# EAGLE design Conduino-V03 (EAGLE 8.5.2)
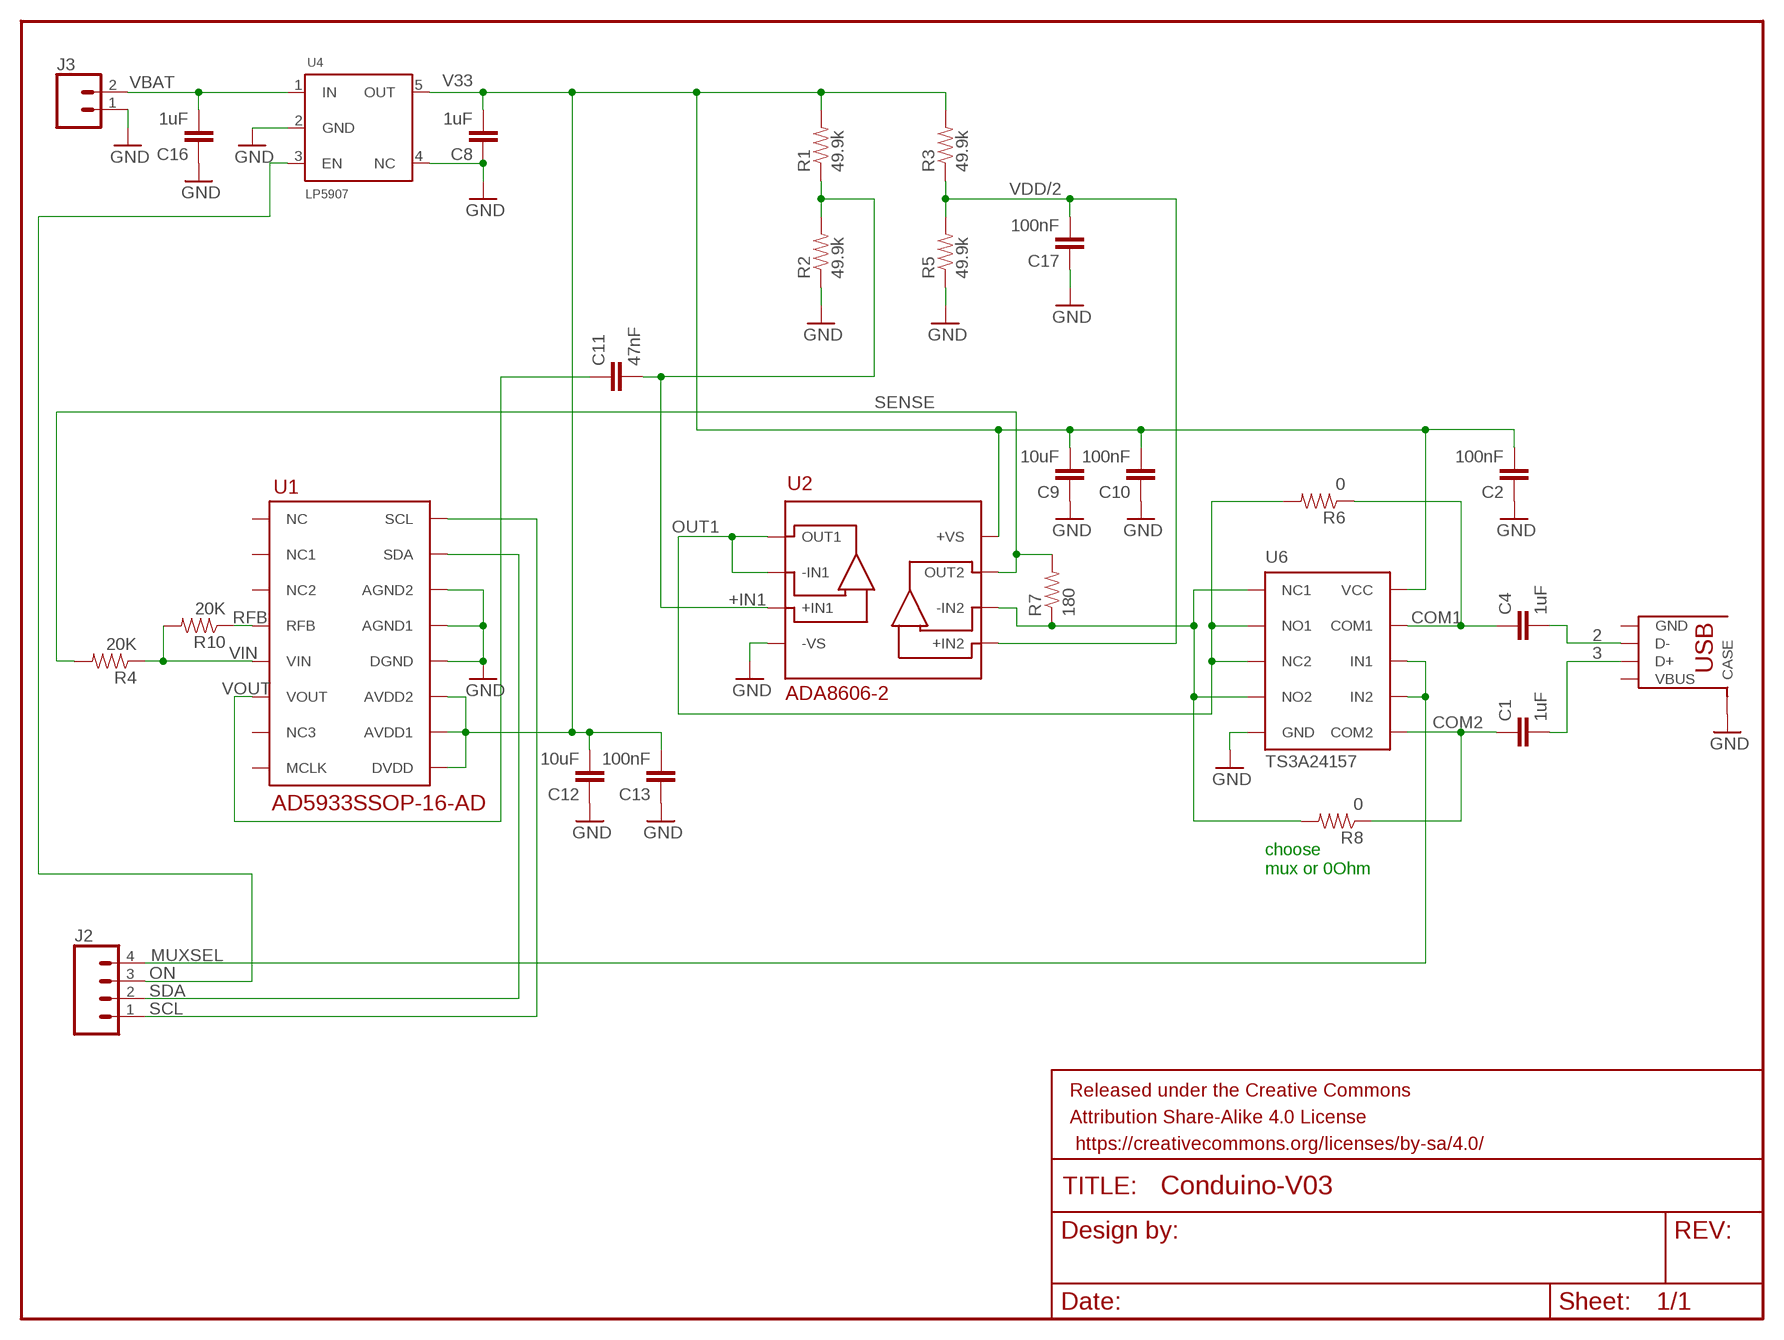
[diagram p0: schematic, sheet 1]

## Parts
C1  1uF  CAP0603-CAP  [0603-CAP]
C2  100nF  CAP0603-CAP  [0603-CAP]
C4  1uF  CAP0603-CAP  [0603-CAP]
C8  1uF  CAP0603-CAP  [0603-CAP]
C9  10uF  CAP0603-CAP  [0603-CAP]
C10  100nF  CAP0603-CAP  [0603-CAP]
C11  47nF  CAP0603-CAP  [0603-CAP]
C12  10uF  CAP0603-CAP  [0603-CAP]
C13  100nF  CAP0603-CAP  [0603-CAP]
C16  1uF  CAP0603-CAP  [0603-CAP]
C17  100nF  CAP0603-CAP  [0603-CAP]
FRAME1  FRAME-LETTER  [CREATIVE_COMMONS]
J1  USBA-SIDE  [USBA-SIDE]
J2  CONN_041X04_NO_SILK  [1X04_NO_SILK]
J3  CONN_021X02_NO_SILK  [1X02_NO_SILK]
R1  49.9k  RESISTOR0603-RES  [0603-RES]
R2  49.9k  RESISTOR0603-RES  [0603-RES]
R3  49.9k  RESISTOR0603-RES  [0603-RES]
R4  20K  RESISTOR0603-RES  [0603-RES]
R5  49.9k  RESISTOR0603-RES  [0603-RES]
R6  0  RESISTOR0603-RES  [0603-RES]
R7  180  RESISTOR0603-RES  [0603-RES]
R8  0  RESISTOR0603-RES  [0603-RES]
R10  20K  RESISTOR0603-RES  [0603-RES]
U1  AD5933SSOP-16-AD  [SSOP-16-AD]
U2  ADA8606-2  [SOIC_N]
U4  LP5907  [SOT23-5L]
U6  TS3A24157  [VSSOP-10]

## Nets
2: C4.2 J1.P$2(D-)
3: C1.2 J1.P$3(D+)
+IN1: C11.2 R1.1 R2.2 U2.P$3(+IN1)
-IN2: R7.1 R8.2 U2.P$6(-IN2) U6.P$1(NC1) U6.P$4(NO2)
COM1: C4.1 R6.1 U6.P$9(COM1)
COM2: C1.1 R8.1 U6.P$6(COM2)
GND: C2.1 C8.1 C9.1 C10.1 C12.1 C13.1 C16.1 C17.1 J1.P$5(CASE) J1.P$6(CASE) J3.1 R2.1 R5.1 U1.P$12(DGND) U1.P$13(AGND1) U1.P$14(AGND2) U2.P$4(-VS) U4.2(GND) U4.4(NC) U6.P$5(GND)
MUXSEL: J2.4 U6.P$7(IN2) U6.P$8(IN1)
ON: J2.3 U4.3(EN)
OUT1: R6.2 U2.P$1(OUT1) U2.P$2(-IN1) U6.P$2(NO1) U6.P$3(NC2)
RFB: R10.1 U1.P$4(RFB)
SCL: J2.1 U1.P$16(SCL)
SDA: J2.2 U1.P$15(SDA)
SENSE: R4.2 R7.2 U2.P$7(OUT2)
V33: C2.2 C8.2 C9.2 C10.2 C12.2 C13.2 R1.2 R3.2 U1.P$9(DVDD) U1.P$10(AVDD1) U1.P$11(AVDD2) U2.P$8(+VS) U4.5(OUT) U6.P$10(VCC)
VBAT: C16.2 J3.2 U4.1(IN)
VDD/2: C17.2 R3.1 R5.2 U2.P$5(+IN2)
VIN: R4.1 R10.2 U1.P$5(VIN)
VOUT: C11.1 U1.P$6(VOUT)
Unconnected: J1.P$1(GND) J1.P$4(VBUS) U1.P$1(NC) U1.P$2(NC1) U1.P$3(NC2) U1.P$7(NC3) U1.P$8(MCLK)

## Notes on the sheet
- choose
  mux or 0Ohm

## Library data of the parts
C1 C2 C4 C8-C13 C16 C17 = SparkFun-Passives:CAP: Capacitor Standard 0603 ceramic capacitor, and 0.1" leaded capacitor.
FRAME1 = SparkFun-Aesthetics:FRAME-LETTER: Schematic Frame Standard 8.5x11 US Letter frame
J1 = KDA:USBA-SIDE
J2 = SparkFun-Connectors:CONN_04: Multi connection point. Often used as Generic Header-pin footprint for 0.1 inch spaced/style header connections On any of the 0.1 inch spaced packages, you can populate with these: Break Away Headers - Straight <https://www.sparkfun.com/products/116> (PRT-00116) Break Away Male Headers - Right Angle <https://www.sparkfun.com/products/553> (PRT-00553) Female Headers <https://www.sparkfun.com/products/115> (PRT-00115) Break Away Headers - Machine Pin <https://www.sparkfun.com/products/117> (PRT-00117) Break Away Female Headers - Swiss Machine Pin <https://www.sparkfun.com/products/743> (PRT-00743) For SCREWTERMINALS and SPRING TERMINALS visit here: Screw Terimnals on SparkFun.com <https://www.sparkfun.com/search/results?term=Screw+Terminals> (5mm/3.5mm/2.54mm spacing) This device is also useful as a general connection point to wire up your design to another part of your project. Our various solder wires solder well into these plated through hole pads. Hook-Up Wire - Assortment (Stranded, 22 AWG) <https://www.sparkfun.com/products/11375> (PRT-11375) Hook-Up Wire - Assortment (Solid Core, 22 AWG) <https://www.sparkfun.com/products/11367> (PRT-11367) View the entire wire category on our website here <https://www.sparkfun.com/categories/141> Special notes: Molex polarized connector foot print use with SKU : PRT-08231 with associated crimp pins and housings. 1MM SMD Version SKU: PRT-10208; PROD_ID: CONN-09696
J3 = SparkFun-Connectors:CONN_02: Multi connection point. Often used as Generic Header-pin footprint for 0.1 inch spaced/style header connections On any of the 0.1 inch spaced packages, you can populate with these: Break Away Headers - Straight <https://www.sparkfun.com/products/116> (PRT-00116) Break Away Male Headers - Right Angle <https://www.sparkfun.com/products/553> (PRT-00553) Female Headers <https://www.sparkfun.com/products/115> (PRT-00115) Break Away Headers - Machine Pin <https://www.sparkfun.com/products/117> (PRT-00117) Break Away Female Headers - Swiss Machine Pin <https://www.sparkfun.com/products/743> (PRT-00743) For SCREWTERMINALS and SPRING TERMINALS visit here: Screw Terimnals on SparkFun.com <https://www.sparkfun.com/search/results?term=Screw+Terminals> (5mm/3.5mm/2.54mm spacing) This device is also useful as a general connection point to wire up your design to another part of your project. Our various solder wires solder well into these plated through hole pads. Hook-Up Wire - Assortment (Stranded, 22 AWG) <https://www.sparkfun.com/products/11375> (PRT-11375) Hook-Up Wire - Assortment (Solid Core, 22 AWG) <https://www.sparkfun.com/products/11367> (PRT-11367) View the entire wire category on our website here <https://www.sparkfun.com/categories/141> Special notes: Molex polarized connector foot print use with: PRT-08233 with associated crimp pins and housings. 2.54_SCREWTERM for use with PRT-10571. 3.5mm Screw Terminal footprints for PRT-08084 5mm Screw Terminal footprints for use with PRT-08432
R1-R8 R10 = SparkFun-Passives:RESISTOR: Resistor Basic schematic elements and footprints for 0603, 1206, and PTH resistors.
U1 = KDA:AD5933
U2 = KDA:ADA8606-2
U4 = KDA:LP5907
U6 = KDA:TS3A24157

## Board
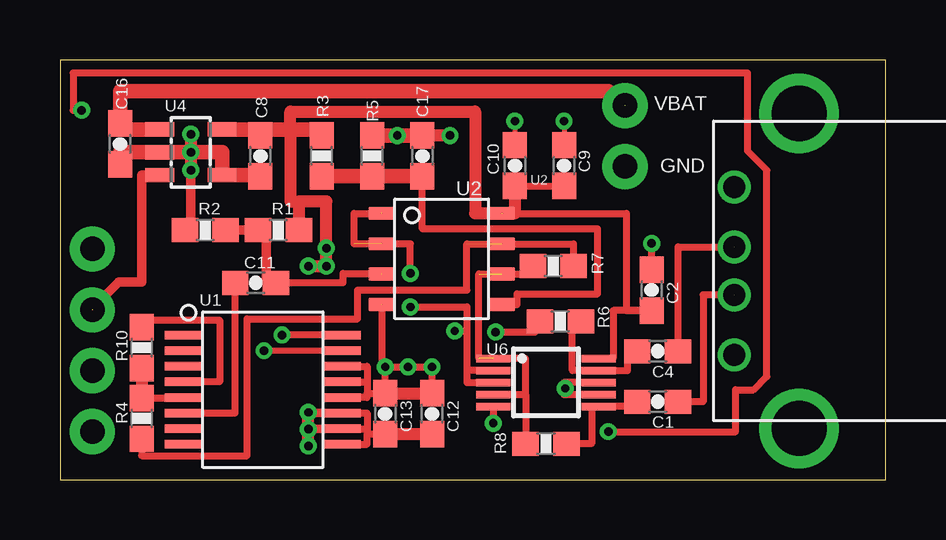
[diagram p1: board, top side]
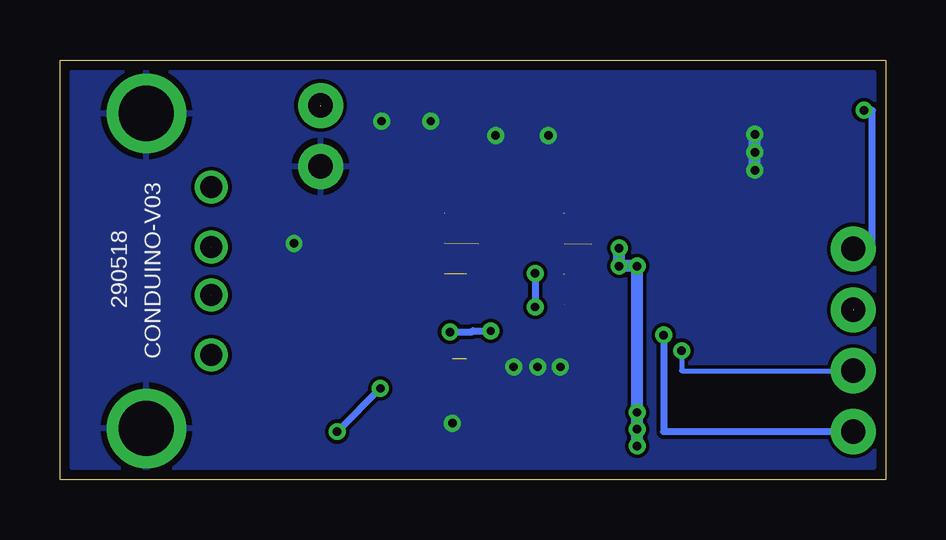
[diagram p2: board, bottom side, seen from below]

Size 34.4 x 17.5 mm. Coordinates in mm from the lower left corner, seen from the top.
Outline: 0,0 34.4,0 34.4,17.5 0,17.5 0,0
Copper layers (1*16): Top 0.0356mm / dielectric 1.5011mm / Bottom 0.0356mm
Design rules "Oshpark_mm": minimum track width 0.15mm, minimum drill 0.33mm, track to track 0.15mm, track to pad 0.15mm, pad to pad 0.15mm, via to via 0.15mm, smd to smd 0.15mm, copper to edge 0.38mm, drill to drill 0.15mm, minimum pad ring 7mil, minimum via ring 7mil, stop-mask expansion 3mil, vias tented up to drill 0mil, thermal gap 10mil

### Footprints (pad centres in the part's own frame; a part is rotated, then mirrored left to right if it is on the bottom)
0603-CAP = smd 1.1 x 1: 1 -0.85,0; 2 0.85,0
USBA-SIDE = drill 0.92: P$1 3.5,2.71; P$2 1,2.71; P$3 -1,2.71; P$4 -3.5,2.71 | drill 2.3: P$5 -6.57,0; P$6 6.57,0
1X04_NO_SILK = drill 1.016 pad 1.88: 1 0,0; 2 2.54,0; 3 5.08,0; 4 7.62,0
1X02_NO_SILK = drill 1.016 pad 1.88: 1 0,0; 2 2.54,0
0603-RES = smd 1.1 x 1: 1 -0.85,0; 2 0.85,0
SSOP-16-AD = smd 1.6 x 0.35: P$1 -3.3,2.275; P$2 -3.3,1.625; P$3 -3.3,0.975; P$4 -3.3,0.325; P$5 -3.3,-0.325; P$6 -3.3,-0.975; P$7 -3.3,-1.625; P$8 -3.3,-2.275; P$9 3.3,-2.275; P$10 3.3,-1.625; P$11 3.3,-0.975; P$12 3.3,-0.325; P$13 3.3,0.325; P$14 3.3,0.975; P$15 3.3,1.625; P$16 3.3,2.275
SOIC_N = smd 1.1 x 0.55: P$1 -2.5,1.905; P$2 -2.5,0.635; P$3 -2.5,-0.635; P$4 -2.5,-1.905; P$5 2.5,-1.905; P$6 2.5,-0.635; P$7 2.5,0.635; P$8 2.5,1.905
SOT23-5L = smd 0.6 x 1.2: 1 -0.95,-1.3; 2 0,-1.3; 3 0.95,-1.3; 4 0.95,1.3; 5 -0.95,1.3
VSSOP-10 = smd 0.3 x 1.45: P$1 -1,-2.2; P$2 -0.5,-2.2; P$3 0,-2.2; P$4 0.5,-2.2; P$5 1,-2.2; P$6 1,2.2; P$7 0.5,2.2; P$8 0,2.2; P$9 -0.5,2.2; P$10 -1,2.2

### Placement (x,y rotation side)
C1  24.9,3.25 0 top
C2  24.65,7.9 270 top
C4  24.9,5.35 0 top
C8  8.35,13.5 90 top
C9  21,13.1 270 top
C10  18.95,13.1 270 top
C11  8.15,8.2 0 top
C12  15.5,2.75 270 top
C13  13.55,2.75 270 top
C16  2.5,14 90 top
C17  15.1,13.5 270 top
FRAME1  0,0 0 top
J1  30.8,8.7 90 top
J2  1.35,2 90 top
J3  23.54,13.06 90 top
R1  9.1,10.4 0 top
R2  6.05,10.4 0 top
R3  10.9,13.5 90 top
R4  3.4,2.55 270 top
R5  13,13.5 270 top
R6  20.85,6.6 180 top
R7  20.55,8.9 0 top
R8  20.25,1.5 180 top
R10  3.4,5.5 270 top
U1  8.45,3.75 0 top
U2  15.9,9.2 0 top
U4  5.45,13.65 270 top
U6  20.25,4.05 270 top

### Tracks (layer width: path | path; a pad name or v marks a point on that pad's centre or on a via)
2  (1 unrouted)
  Top 0.3: C4.2 25.75,9.7 J1.P$2
3  (1 unrouted)
  Top 0.3: J1.P$3 26.8,7.7 26.8,3.25 C1.2
+IN1  (1 unrouted)
  Top 0.3: C11.2 11.8,8.2 11.8,8.6 13.6,8.6 13.65,8.5 U2.P$3
  Top 0.4: R2.2 R1.1 8.6,10.4 8.6,8.2 C11.2
-IN2  (2 unrouted)
  Top 0.3: R7.1 19.95,8.57 17.45,8.57 17.45,5.05 | U6.P$4 19.4,3.55 | 19.4,3.55 19.4,5.05 U6.P$1 | 19.4,3.55 R8.2
COM1
  Top 0.3: C4.1 23.65,5.35 23.65,4.55 U6.P$9 21.35,4.55 21.35,6.65 R6.1
COM2
  Top 0.3: C1.1 24.05,3.05 U6.P$6 22.15,3.05 22.15,1.5 R8.1
GND  (via drill 0.35)  (1 unrouted)
  Top 0.2: 12.8,3.6 12.8,3.42 | v21,14.95 C9.1 | v18.95,14.95 C10.1
  Top 0.3: U1.P$14 12.8,4.72 12.8,4.08 | 12.8,4.08 12.8,3.6 C13.1 v13.55,4.7 v14.5,4.7 | U1.P$13 12.8,4.08 | 12.8,3.42 U1.P$12 | C12.1 v15.5,4.7 v14.5,4.7 | U2.P$4 13.4,4.7 v14.5,4.7 | C2.1 v24.65,9.85 | U6.P$5 v18.05,2.35
  Top 0.4: R2.1 5.45,10.4 v5.45,12.9
  Top 0.5: C13.1 C12.1 | v5.45,14.4 v5.45,13.65 v5.45,12.9 | v16.25,14.35 C17.1
  Top 0.6: C16.1 2.5,13.65 U4.2 v5.45,13.65 6.75,13.65 U4.4 8.35,12.7 C8.1 | R5.1 v14.05,14.35 C17.1
  Bottom 0.5: v5.45,12.9 v5.45,13.65 v5.45,14.4
  pour Bottom (isolate 0.15): 0.5,17 0.5,0.5 33.9,0.5 33.9,17
MUXSEL  (via drill 0.35)
  Top 0.3: U6.P$8 21,4.05 21,3.85 | 21,3.85 21,3.55 U6.P$7 | v22.85,2 28.15,2 28.15,3.75 28.9,3.75 29.45,4.3 29.45,12.9 28.65,13.7 28.65,16.95 0.55,16.95 0.55,15.4 v0.9,15.4 | v21.05,3.8 21,3.85
  Bottom 0.3: J2.4 0.55,9.62 0.55,15.4 v0.9,15.4 | v21.05,3.8 v22.85,2
ON  (1 unrouted)
  Top 0.4: U4.3 3.4,12.7 3.4,8.25 2.45,8.25 1.35,7.15 J2.3
OUT1  (via drill 0.35)  (2 unrouted)
  Top 0.3: U2.P$1 12.25,11.1 12.25,9.82 14.6,9.82 v14.6,8.6 | v14.6,7.2 16.95,7.2 16.95,6.2 | 16.95,6.2 16.95,4.55 | U6.P$2 16.95,4.55 | 16.95,4.55 16.95,4.05 U6.P$3 | v16.45,6.2 16.95,6.2 | v18.15,6.15 19.8,6.15 R6.2
  Bottom 0.3: v14.6,8.6 v14.6,7.2 | v18.15,6.15 17.25,6.15 17.2,6.2 v16.45,6.2
RFB
  Top 0.3: R10.1 3.4,6.65 6.65,6.65 6.65,4.08 U1.P$4
SCL  (via drill 0.35)
  Top 0.3: U1.P$16 v9.25,6.03
  Bottom 0.3: J2.1 9.25,2 v9.25,6.03
SDA  (via drill 0.35)
  Top 0.25: U1.P$15 v8.5,5.38
  Bottom 0.2: J2.2 8.5,4.54 v8.5,5.38
SENSE  (1 unrouted)
  Top 0.3: R4.2 3.4,1 7.8,1 7.8,6.7 12.4,6.7 12.4,7.9 16.95,7.9 16.95,9.82 21.4,9.82 R7.2
V33  (via drill 0.35)  (1 unrouted)
  Top 0.3: U1.P$11 12.8,2.77 12.8,1.9 | 12.8,1.9 C13.2 | U1.P$9 12.8,1.48 12.8,1.9 | U1.P$10 12.8,2.12 | C10.2 C9.2 | U2.P$8 18.95,11.1 23.6,11.1 23.6,7.05 C2.2 23.05,7.05 23.05,5.05 U6.P$10
  Top 0.35: v10.35,2.8 10.35,2.77 | U1.P$10 10.35,2.12 10.35,2.77 | U1.P$11 10.35,2.77
  Top 0.5: C13.2 C12.2 | 9.95,11.6 9.6,11.6 9.6,14.6 9.6,15.35 17.3,15.35 17.3,11.11 U2.P$8 | 9.95,11.6 R1.2 | v10.35,1.4 v10.35,2.1 10.35,2.77 v10.35,2.8 | v10.35,8.9 v11.1,8.9 v11.1,9.65 11.1,11.6 9.95,11.6 | C10.2 18.95,11.1
  Top 0.6: U4.5 8.35,14.6 | C8.2 8.35,14.6 | 8.35,14.6 9.6,14.6 10.9,14.6 R3.2
  Bottom 0.5: v10.35,1.4 v10.35,2.1 v10.35,2.8 v10.35,8.9 v11.1,8.9 v11.1,9.65
VBAT  (1 unrouted)
  Top 0.508: 2.75,14.6 C16.2
  Top 0.6: U4.1 2.75,14.6 | C16.2 2.5,16.2 22.85,16.2 23.25,15.6 23.55,15.6
VDD/2
  Top 0.3: U2.P$5 19.05,7.29 19.05,7.75 22.4,7.75 22.4,10.45 15.1,10.45 C17.2
  Top 0.6: R3.1 R5.2 C17.2
VIN
  Top 0.2: 5.12,3.4 U1.P$5
  Top 0.3: R4.1 5.12,3.4
  Top 0.5: R10.2 R4.1
VOUT
  Top 0.3: U1.P$6 7.3,2.77 C11.1

### Text on the board
tPlace: U4 | VBAT | GND | U2 | U2 | U1 | U6
bPlace: CONDUINO-V03 | 290518